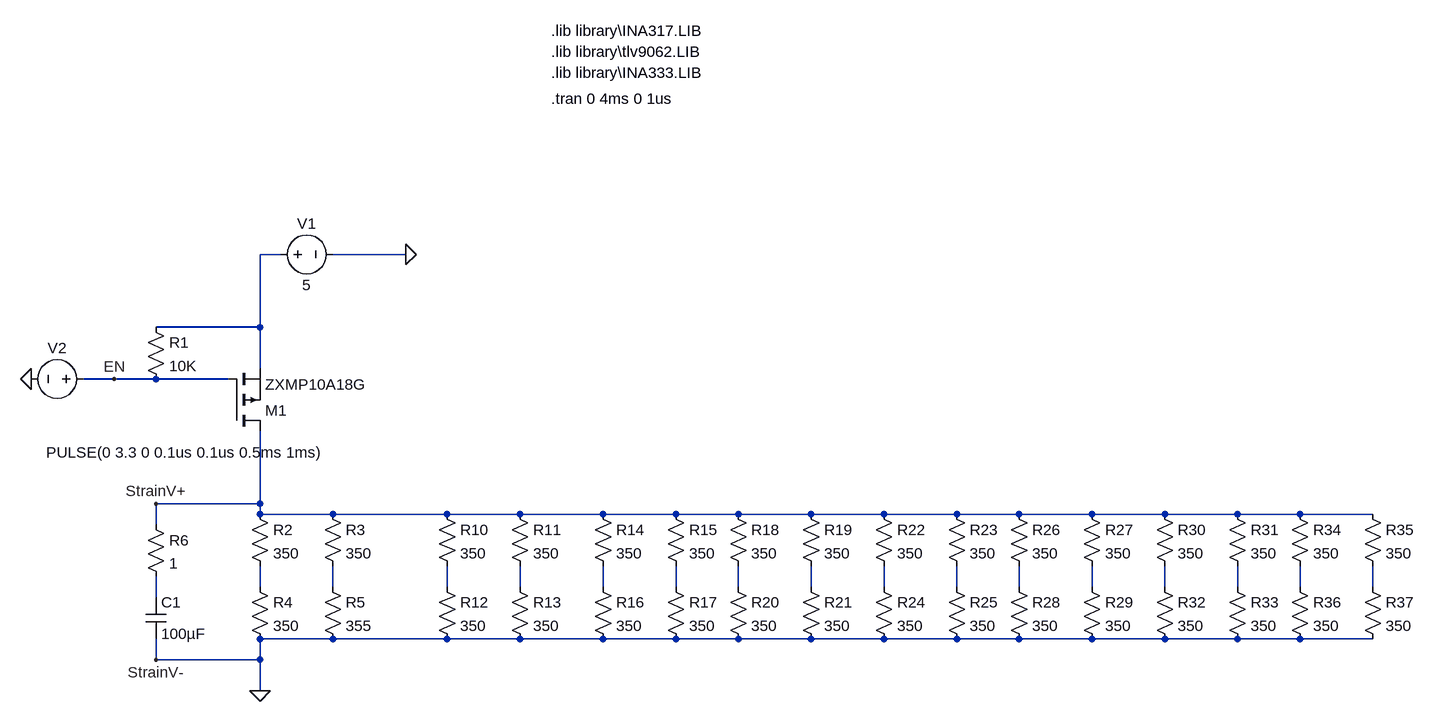
[diagram p0: schematic NMOS_switchingStrainV.asc]
NMOS_switchingStrainV.asc, the LTspice schematic file:
Version 4.1
SHEET 1 2284 1760
WIRE 32 -128 0 -128
WIRE 224 -128 112 -128
WIRE 0 -16 0 -128
WIRE 0 -16 -160 -16
WIRE 0 48 0 -16
WIRE -224 64 -272 64
WIRE -160 64 -224 64
WIRE -48 64 -160 64
WIRE 0 256 0 144
WIRE 0 256 -160 256
WIRE 0 272 0 256
WIRE 112 272 0 272
WIRE 288 272 112 272
WIRE 400 272 288 272
WIRE 528 272 400 272
WIRE 640 272 528 272
WIRE 736 272 640 272
WIRE 848 272 736 272
WIRE 960 272 848 272
WIRE 1072 272 960 272
WIRE 1168 272 1072 272
WIRE 1280 272 1168 272
WIRE 1392 272 1280 272
WIRE 1504 272 1392 272
WIRE 1600 272 1504 272
WIRE 1712 272 1600 272
WIRE -160 288 -160 256
WIRE 0 384 0 352
WIRE 112 384 112 352
WIRE 288 384 288 352
WIRE 400 384 400 352
WIRE 528 384 528 352
WIRE 640 384 640 352
WIRE 736 384 736 352
WIRE 848 384 848 352
WIRE 960 384 960 352
WIRE 1072 384 1072 352
WIRE 1168 384 1168 352
WIRE 1280 384 1280 352
WIRE 1392 384 1392 352
WIRE 1504 384 1504 352
WIRE 1600 384 1600 352
WIRE 1712 384 1712 352
WIRE -160 400 -160 368
WIRE 112 464 0 464
WIRE 288 464 112 464
WIRE 400 464 288 464
WIRE 528 464 400 464
WIRE 640 464 528 464
WIRE 736 464 640 464
WIRE 848 464 736 464
WIRE 960 464 848 464
WIRE 1072 464 960 464
WIRE 1168 464 1072 464
WIRE 1280 464 1168 464
WIRE 1392 464 1280 464
WIRE 1504 464 1392 464
WIRE 1600 464 1504 464
WIRE 1712 464 1600 464
WIRE -160 496 -160 464
WIRE 0 496 0 464
WIRE 0 496 -160 496
WIRE 0 544 0 496
FLAG 224 -128 0
FLAG -160 256 StrainV+
FLAG -160 496 StrainV-
FLAG -224 64 EN
FLAG 0 544 0
FLAG -352 64 0
SYMBOL voltage 16 -128 R270
WINDOW 0 32 56 VTop 2
WINDOW 3 -32 56 VBottom 2
WINDOW 123 0 0 Left 0
WINDOW 39 0 0 Left 0
SYMATTR InstName V1
SYMATTR Value 5
SYMBOL voltage -256 64 R90
WINDOW 0 -32 56 VBottom 2
WINDOW 3 97 -140 VTop 2
WINDOW 123 0 0 Left 0
WINDOW 39 0 0 Left 0
SYMATTR InstName V2
SYMATTR Value PULSE(0 3.3 0 0.1us 0.1us 0.5ms 1ms)
SYMBOL res -16 256 R0
SYMATTR InstName R2
SYMATTR Value 350
SYMBOL res 96 256 R0
SYMATTR InstName R3
SYMATTR Value 350
SYMBOL res -16 368 R0
SYMATTR InstName R4
SYMATTR Value 350
SYMBOL res 272 256 R0
SYMATTR InstName R10
SYMATTR Value 350
SYMBOL res 384 256 R0
SYMATTR InstName R11
SYMATTR Value 350
SYMBOL res 272 368 R0
SYMATTR InstName R12
SYMATTR Value 350
SYMBOL res 384 368 R0
SYMATTR InstName R13
SYMATTR Value 350
SYMBOL res 512 256 R0
SYMATTR InstName R14
SYMATTR Value 350
SYMBOL res 624 256 R0
SYMATTR InstName R15
SYMATTR Value 350
SYMBOL res 512 368 R0
SYMATTR InstName R16
SYMATTR Value 350
SYMBOL res 624 368 R0
SYMATTR InstName R17
SYMATTR Value 350
SYMBOL res 720 256 R0
SYMATTR InstName R18
SYMATTR Value 350
SYMBOL res 832 256 R0
SYMATTR InstName R19
SYMATTR Value 350
SYMBOL res 720 368 R0
SYMATTR InstName R20
SYMATTR Value 350
SYMBOL res 832 368 R0
SYMATTR InstName R21
SYMATTR Value 350
SYMBOL res 944 256 R0
SYMATTR InstName R22
SYMATTR Value 350
SYMBOL res 1056 256 R0
SYMATTR InstName R23
SYMATTR Value 350
SYMBOL res 944 368 R0
SYMATTR InstName R24
SYMATTR Value 350
SYMBOL res 1056 368 R0
SYMATTR InstName R25
SYMATTR Value 350
SYMBOL res 1152 256 R0
SYMATTR InstName R26
SYMATTR Value 350
SYMBOL res 1264 256 R0
SYMATTR InstName R27
SYMATTR Value 350
SYMBOL res 1152 368 R0
SYMATTR InstName R28
SYMATTR Value 350
SYMBOL res 1264 368 R0
SYMATTR InstName R29
SYMATTR Value 350
SYMBOL res 1376 256 R0
SYMATTR InstName R30
SYMATTR Value 350
SYMBOL res 1488 256 R0
SYMATTR InstName R31
SYMATTR Value 350
SYMBOL res 1376 368 R0
SYMATTR InstName R32
SYMATTR Value 350
SYMBOL res 1488 368 R0
SYMATTR InstName R33
SYMATTR Value 350
SYMBOL res 1584 256 R0
SYMATTR InstName R34
SYMATTR Value 350
SYMBOL res 1696 256 R0
SYMATTR InstName R35
SYMATTR Value 350
SYMBOL res 1584 368 R0
SYMATTR InstName R36
SYMATTR Value 350
SYMBOL res 1696 368 R0
SYMATTR InstName R37
SYMATTR Value 350
SYMBOL res 96 368 R0
SYMATTR InstName R5
SYMATTR Value 355
SYMBOL pmos -48 144 M180
SYMATTR InstName M1
SYMATTR Value ZXMP10A18G
SYMBOL res -176 -32 R0
SYMATTR InstName R1
SYMATTR Value 10K
SYMBOL cap -176 400 R0
SYMATTR InstName C1
SYMATTR Value 100µF
SYMBOL res -176 272 R0
SYMATTR InstName R6
SYMATTR Value 1
TEXT 448 -472 Left 2 !.lib library\\INA317.LIB
TEXT 448 -440 Left 2 !.lib library\\tlv9062.LIB
TEXT 448 -408 Left 2 !.lib library\\INA333.LIB
TEXT 448 -368 Left 2 !.tran 0 4ms 0 1us

The netlist it stands for:
* NMOS_switchingStrainV.asc
V1 N001 0 5
V2 EN 0 PULSE(0 3.3 0 0.1us 0.1us 0.5ms 1ms)
R2 StrainV+ N002 350
R3 StrainV+ N003 350
R4 N002 0 350
R10 StrainV+ N004 350
R11 StrainV+ N005 350
R12 N004 0 350
R13 N005 0 350
R14 StrainV+ N006 350
R15 StrainV+ N007 350
R16 N006 0 350
R17 N007 0 350
R18 StrainV+ N008 350
R19 StrainV+ N009 350
R20 N008 0 350
R21 N009 0 350
R22 StrainV+ N010 350
R23 StrainV+ N011 350
R24 N010 0 350
R25 N011 0 350
R26 StrainV+ N012 350
R27 StrainV+ N013 350
R28 N012 0 350
R29 N013 0 350
R30 StrainV+ N014 350
R31 StrainV+ N015 350
R32 N014 0 350
R33 N015 0 350
R34 StrainV+ N016 350
R35 StrainV+ N017 350
R36 N016 0 350
R37 N017 0 350
R5 N003 0 355
M1 StrainV+ EN N001 N001 ZXMP10A18G
R1 N001 EN 10K
C1 N018 0 100µF
R6 StrainV+ N018 1
.model NMOS NMOS
.model PMOS PMOS
.lib standard.mos
.lib library\INA317.LIB
.lib library\tlv9062.LIB
.lib library\INA333.LIB
.tran 0 4ms 0 1us
.backanno
.end